# EAGLE design lcstudio-sdcard-leveler (EAGLE 7.1.0)
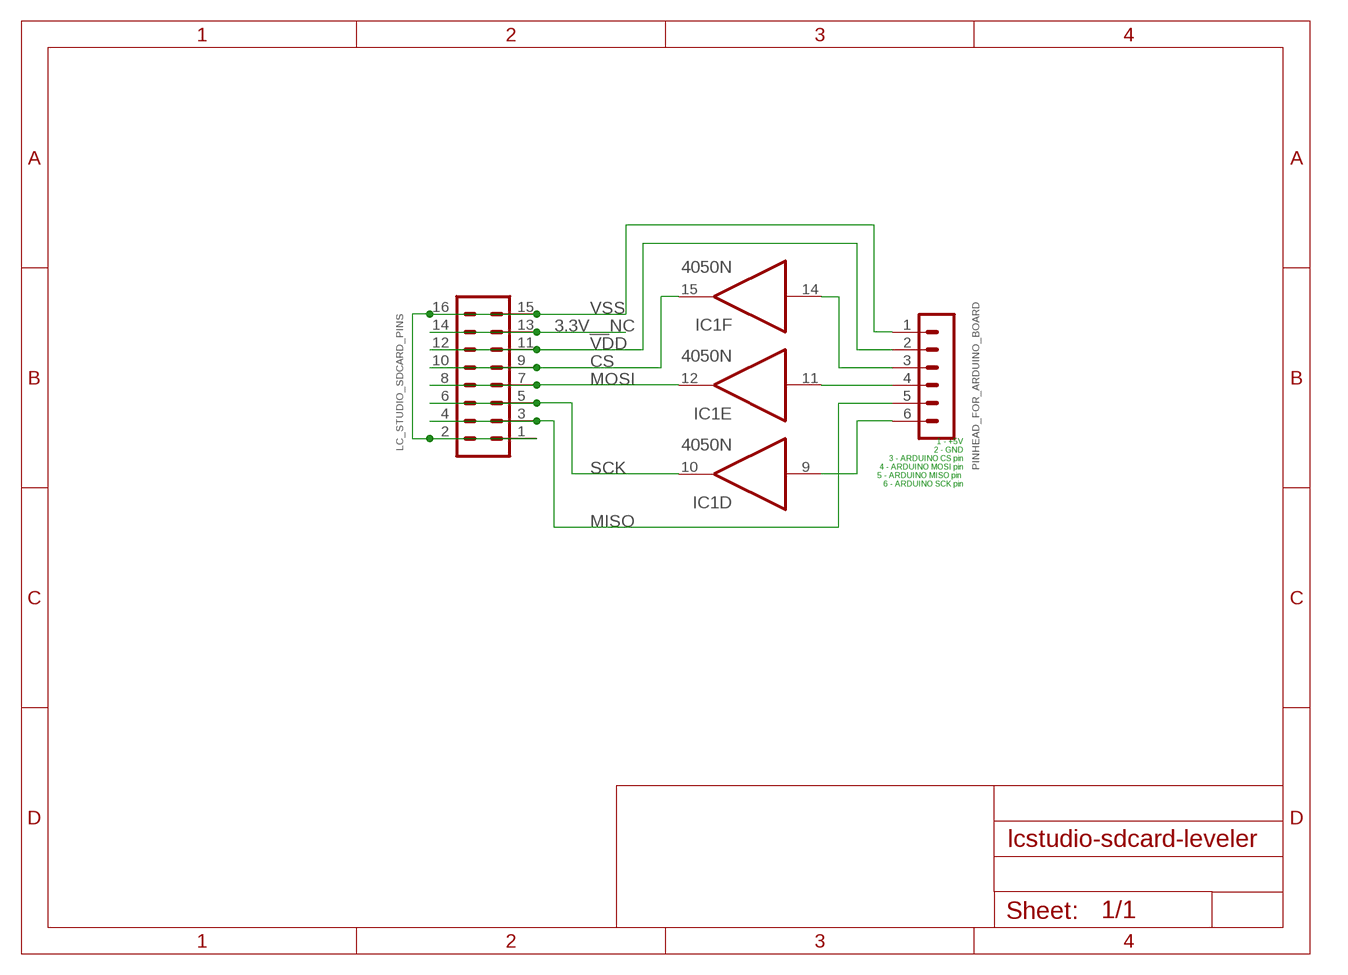
[diagram p0: schematic, sheet 1]

## Parts
IC1  4050N  [DIL16]
LC_STUDIO_SDCARD_PINS  MA08-2  [MA08-2]
PINHEAD_FOR_ARDUINO_BOARD  MA06-1  [MA06-1]

## Nets
3.3V__NC: LC_STUDIO_SDCARD_PINS.13 LC_STUDIO_SDCARD_PINS.14
A-CS: IC1.14(F:I) PINHEAD_FOR_ARDUINO_BOARD.3
CS: IC1.15(F:O) LC_STUDIO_SDCARD_PINS.9 LC_STUDIO_SDCARD_PINS.10
MISO: LC_STUDIO_SDCARD_PINS.3 LC_STUDIO_SDCARD_PINS.4 PINHEAD_FOR_ARDUINO_BOARD.5
MOSI: IC1.12(E:O) LC_STUDIO_SDCARD_PINS.7 LC_STUDIO_SDCARD_PINS.8
N$2: IC1.9(D:I) PINHEAD_FOR_ARDUINO_BOARD.6
N$3: IC1.11(E:I) PINHEAD_FOR_ARDUINO_BOARD.4
SCK: IC1.10(D:O) LC_STUDIO_SDCARD_PINS.5 LC_STUDIO_SDCARD_PINS.6
VDD: LC_STUDIO_SDCARD_PINS.11 LC_STUDIO_SDCARD_PINS.12 PINHEAD_FOR_ARDUINO_BOARD.2
VSS: LC_STUDIO_SDCARD_PINS.1 LC_STUDIO_SDCARD_PINS.2 LC_STUDIO_SDCARD_PINS.15 LC_STUDIO_SDCARD_PINS.16 PINHEAD_FOR_ARDUINO_BOARD.1
Unconnected: IC1.2(A:O) IC1.3(A:I) IC1.4(B:O) IC1.5(B:I) IC1.6(C:O) IC1.7(C:I)

## Notes on the sheet
- 1 - +5V
  2 - GND
  3 - ARDUINO CS pin
  4 - ARDUINO MOSI pin
  5 - ARDUINO MISO pin 
  6 - ARDUINO SCK pin

## Power pins joined to a net without a drawn wire
VDD: IC1.1(P:VDD)
VSS: IC1.8(P:VSS)

## Library data of the parts
IC1 = 40xx:4050: Hex non-inverting BUFFER
LC_STUDIO_SDCARD_PINS = con-lstb:MA08-2: PIN HEADER; OC_FARNELL: unknown; OC_NEWARK: unknown
PINHEAD_FOR_ARDUINO_BOARD = con-lstb:MA06-1: PIN HEADER; OC_FARNELL: unknown; OC_NEWARK: unknown

## Board
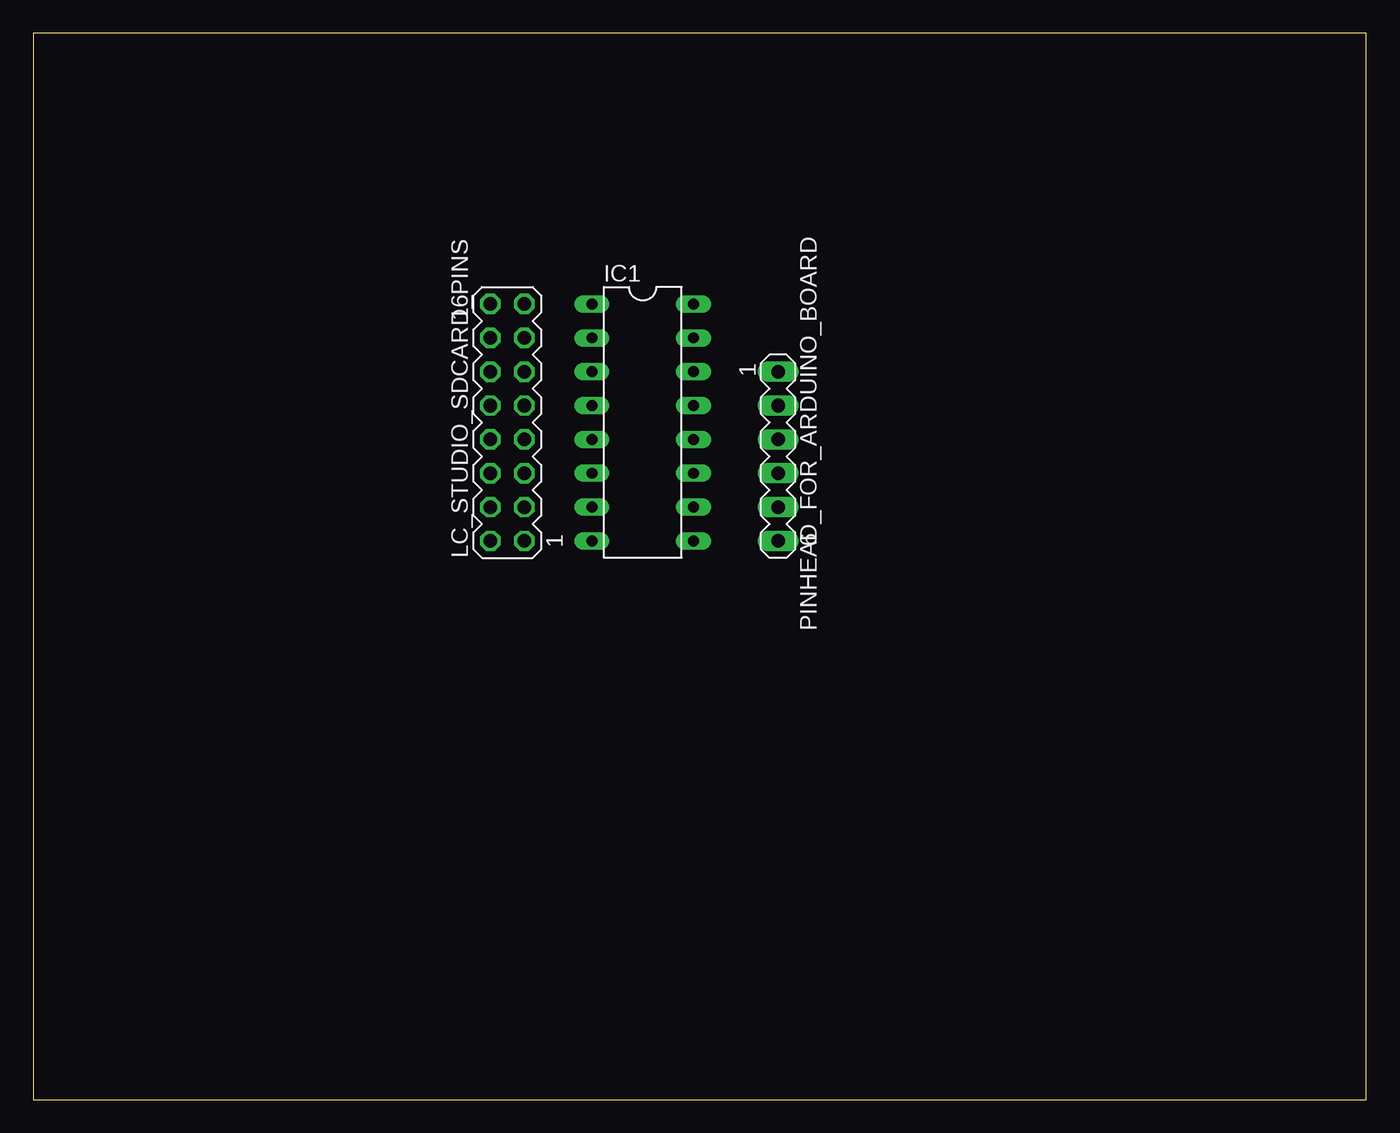
[diagram p1: board, top side]
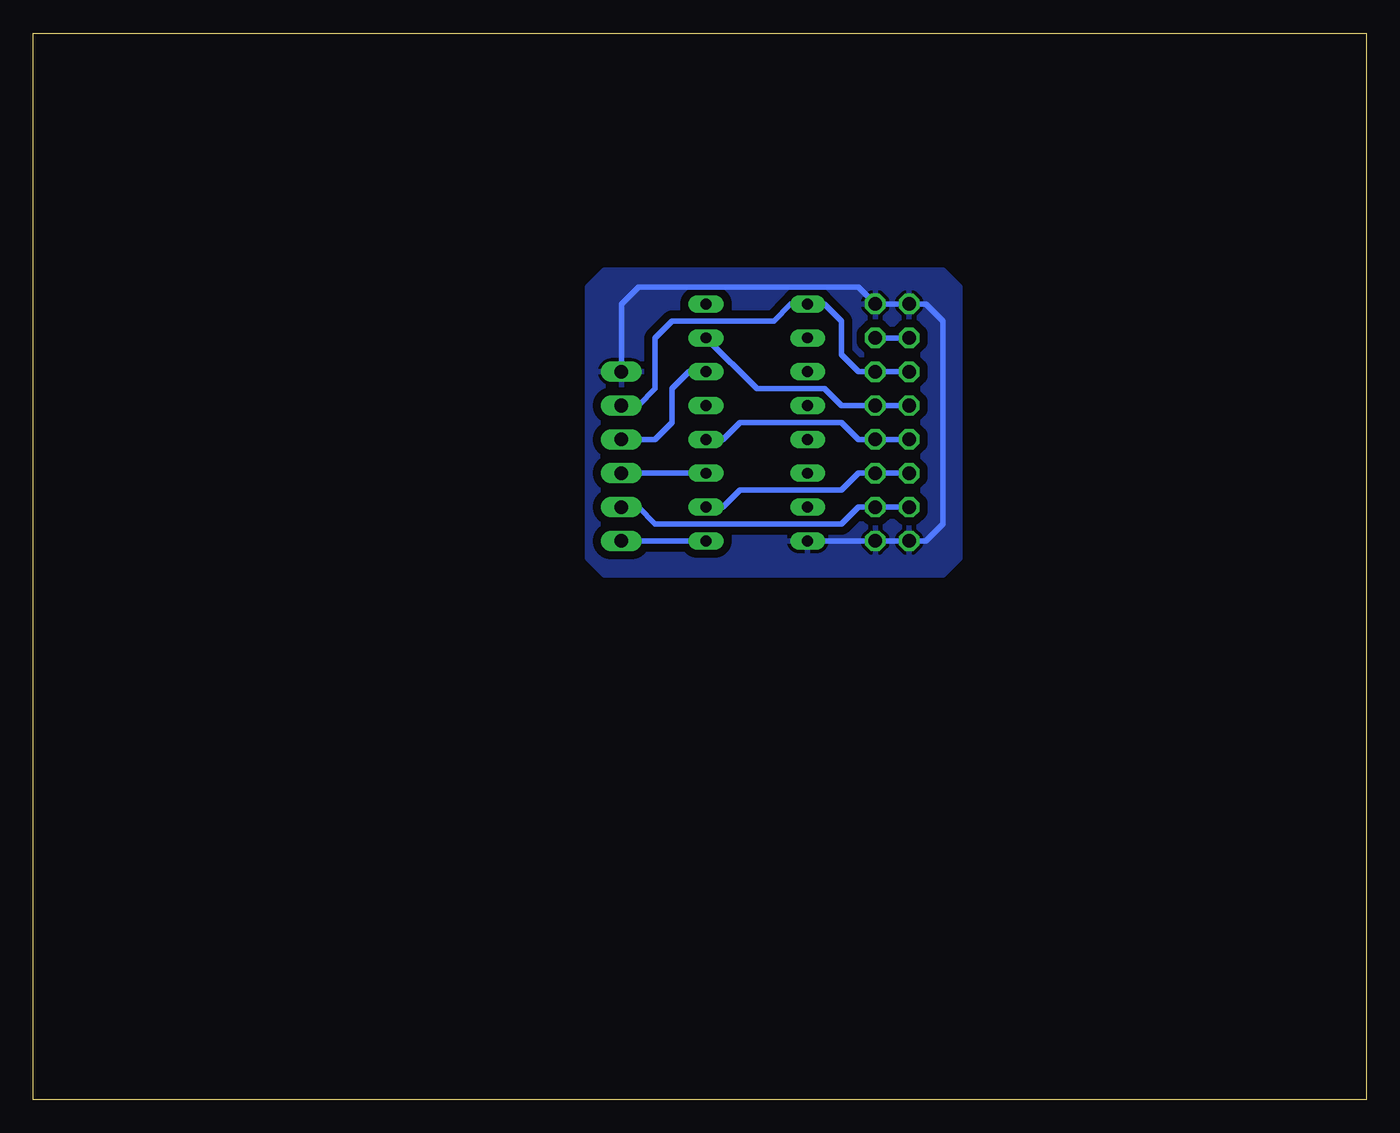
[diagram p2: board, bottom side, seen from below]

Size 100 x 80 mm. Coordinates in mm from the lower left corner, seen from the top.
Outline: 0,0 100,0 100,80 0,80 0,0
Copper layers (1*16): Top 0.035mm / dielectric 1.5mm / Bottom 0.035mm
Design rules "default": minimum track width 10mil, minimum drill 24mil, track to track 8mil, track to pad 8mil, pad to pad 8mil, via to via 8mil, smd to smd 8mil, copper to edge 40mil, drill to drill 8mil, minimum pad ring 10mil, minimum via ring 8mil, stop-mask expansion 4mil, vias tented up to drill 0mil, thermal gap 10mil

### Footprints (pad centres in the part's own frame; a part is rotated, then mirrored left to right if it is on the bottom)
DIL16 = drill 0.813 long: 1 -8.89,-3.81; 2 -6.35,-3.81; 3 -3.81,-3.81; 4 -1.27,-3.81; 5 1.27,-3.81; 6 3.81,-3.81; 7 6.35,-3.81; 8 8.89,-3.81; 9 8.89,3.81; 10 6.35,3.81; 11 3.81,3.81; 12 1.27,3.81; 13 -1.27,3.81; 14 -3.81,3.81; 15 -6.35,3.81; 16 -8.89,3.81
MA08-2 = drill 1.016 octagon: 1 -8.89,-1.27; 2 -8.89,1.27; 3 -6.35,-1.27; 4 -6.35,1.27; 5 -3.81,-1.27; 6 -3.81,1.27; 7 -1.27,-1.27; 8 -1.27,1.27; 9 1.27,-1.27; 10 1.27,1.27; 11 3.81,-1.27; 12 3.81,1.27; 13 6.35,-1.27; 14 6.35,1.27; 15 8.89,-1.27; 16 8.89,1.27
MA06-1 = drill 1.016 long: 1 -6.35,0; 2 -3.81,0; 3 -1.27,0; 4 1.27,0; 5 3.81,0; 6 6.35,0

### Placement (x,y rotation side)
IC1  45.72,50.8 270 top
LC_STUDIO_SDCARD_PINS  35.56,50.8 90 top
PINHEAD_FOR_ARDUINO_BOARD  55.88,48.26 270 top

### Tracks (layer width: path | path; a pad name or v marks a point on that pad's centre or on a via)
3.3V__NC
  Bottom 0.406: LC_STUDIO_SDCARD_PINS.14 LC_STUDIO_SDCARD_PINS.13
A-CS
  Bottom 0.406: PINHEAD_FOR_ARDUINO_BOARD.3 53.34,49.53 52.07,50.8 52.07,53.34 50.8,54.61 IC1.14
CS
  Bottom 0.406: LC_STUDIO_SDCARD_PINS.10 LC_STUDIO_SDCARD_PINS.9 39.37,52.07 40.64,53.34 45.72,53.34 IC1.15
MISO
  Bottom 0.406: LC_STUDIO_SDCARD_PINS.4 LC_STUDIO_SDCARD_PINS.3 38.1,44.45 39.37,43.18 53.34,43.18 54.61,44.45 PINHEAD_FOR_ARDUINO_BOARD.5
MOSI
  Bottom 0.406: LC_STUDIO_SDCARD_PINS.8 LC_STUDIO_SDCARD_PINS.7 38.1,49.53 39.37,50.8 46.99,50.8 48.26,49.53 IC1.12
N$2
  Bottom 0.406: PINHEAD_FOR_ARDUINO_BOARD.6 IC1.9
N$3
  Bottom 0.406: PINHEAD_FOR_ARDUINO_BOARD.4 IC1.11
SCK
  Bottom 0.406: LC_STUDIO_SDCARD_PINS.6 LC_STUDIO_SDCARD_PINS.5 38.1,46.99 39.37,45.72 46.99,45.72 48.26,44.45 IC1.10
VDD
  Bottom 0.406: LC_STUDIO_SDCARD_PINS.12 LC_STUDIO_SDCARD_PINS.11 38.1,54.61 39.37,55.88 39.37,58.42 40.64,59.69 IC1.1 43.18,59.69 44.45,58.42 52.07,58.42 53.34,57.15 53.34,53.34 54.61,52.07 PINHEAD_FOR_ARDUINO_BOARD.2
VSS
  Bottom 0.406: LC_STUDIO_SDCARD_PINS.16 LC_STUDIO_SDCARD_PINS.15 | LC_STUDIO_SDCARD_PINS.15 33.02,59.69 31.75,58.42 31.75,43.18 33.02,41.91 LC_STUDIO_SDCARD_PINS.2 LC_STUDIO_SDCARD_PINS.1 IC1.8 | LC_STUDIO_SDCARD_PINS.15 38.1,60.96 54.61,60.96 55.88,59.69 PINHEAD_FOR_ARDUINO_BOARD.1
  pour Bottom (isolate 0.61): 58.42,40.64 57.15,39.37 31.75,39.37 30.48,40.64 30.48,60.96 31.75,62.23 57.15,62.23 58.42,60.96